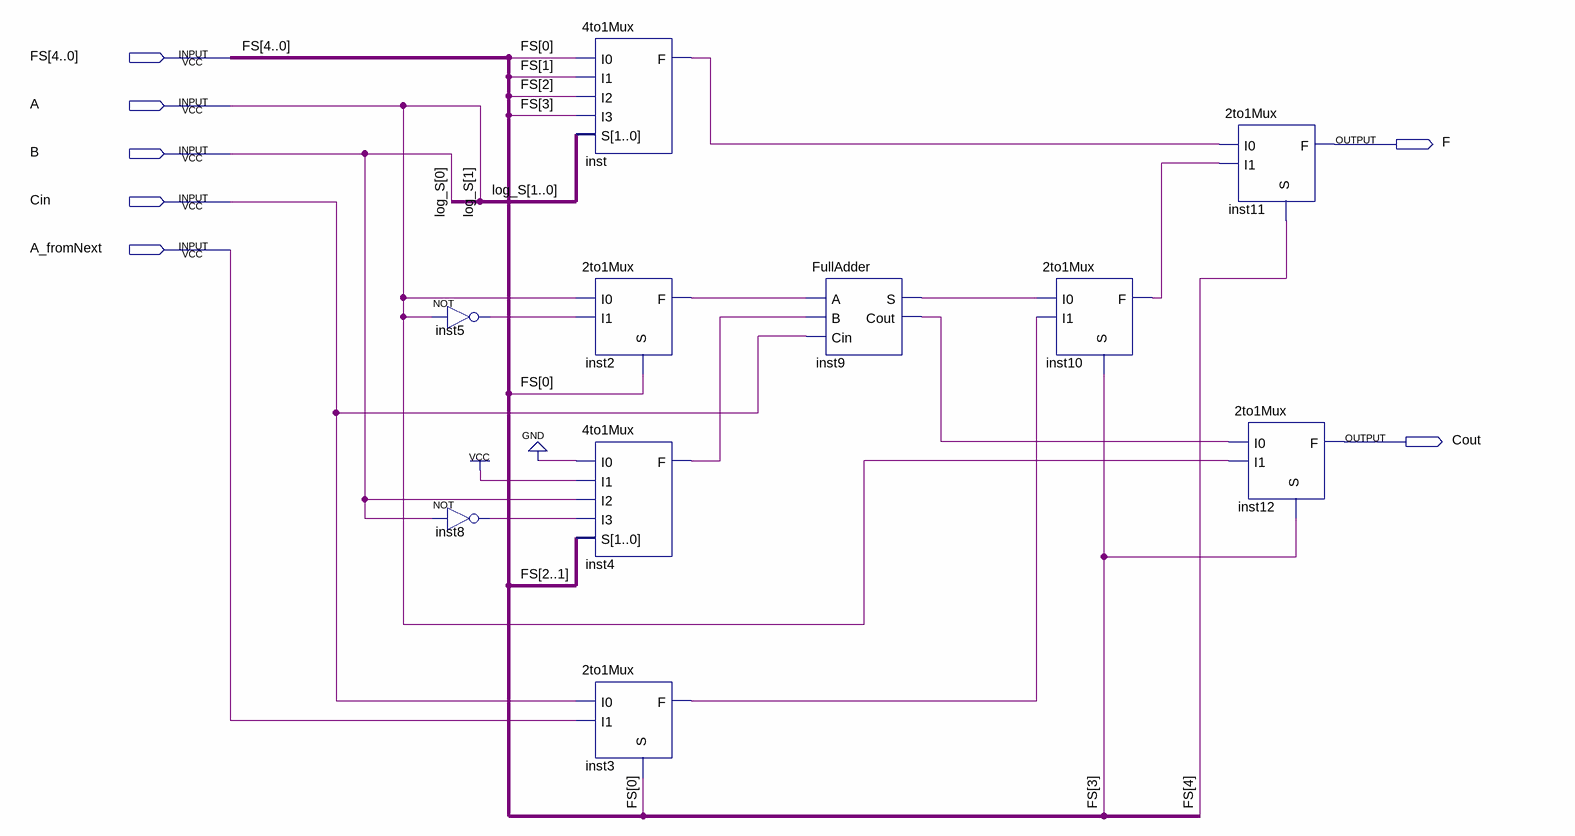
[diagram p0: schematic sheet]
// Quartus schematic CellForALU.bdf as structural Verilog: 10 symbols, 7 pins
module CellForALU (
  input  [4:0] FS,
  input  A,
  input  B,
  input  Cin,
  input  A_fromNext,
  output F,
  output Cout
);

  wire inst2_f, inst3_f, inst4_f, inst5_out, inst8_out, inst9_cout, inst9_s, inst10_f, inst_f;

  not inst5 (inst5_out, A);
  not inst8 (inst8_out, B);
  \4to1Mux  inst (.I0(FS[0]), .I1(FS[1]), .I2(FS[2]), .I3(FS[3]), .S({A, B}), .F(inst_f));
  \2to1Mux  inst2 (.I0(A), .I1(inst5_out), .S(FS[0]), .F(inst2_f));
  \4to1Mux  inst4 (.I0(1'b0), .I1(1'b1), .I2(B), .I3(inst8_out), .S(FS[2:1]), .F(inst4_f));
  \2to1Mux  inst3 (.I0(Cin), .I1(A_fromNext), .S(FS[0]), .F(inst3_f));
  FullAdder inst9 (.A(inst2_f), .B(inst4_f), .Cin(Cin), .S(inst9_s), .Cout(inst9_cout));
  \2to1Mux  inst10 (.I0(inst9_s), .I1(inst3_f), .S(FS[3]), .F(inst10_f));
  \2to1Mux  inst11 (.I0(inst_f), .I1(inst10_f), .S(FS[4]), .F(F));
  \2to1Mux  inst12 (.I0(inst9_cout), .I1(A), .S(FS[3]), .F(Cout));

  // Other names for the same wires on the sheet: log_S[1:0] = {A, B}
endmodule
